# Altium schematic sheet rtpi.SchDoc
size A4
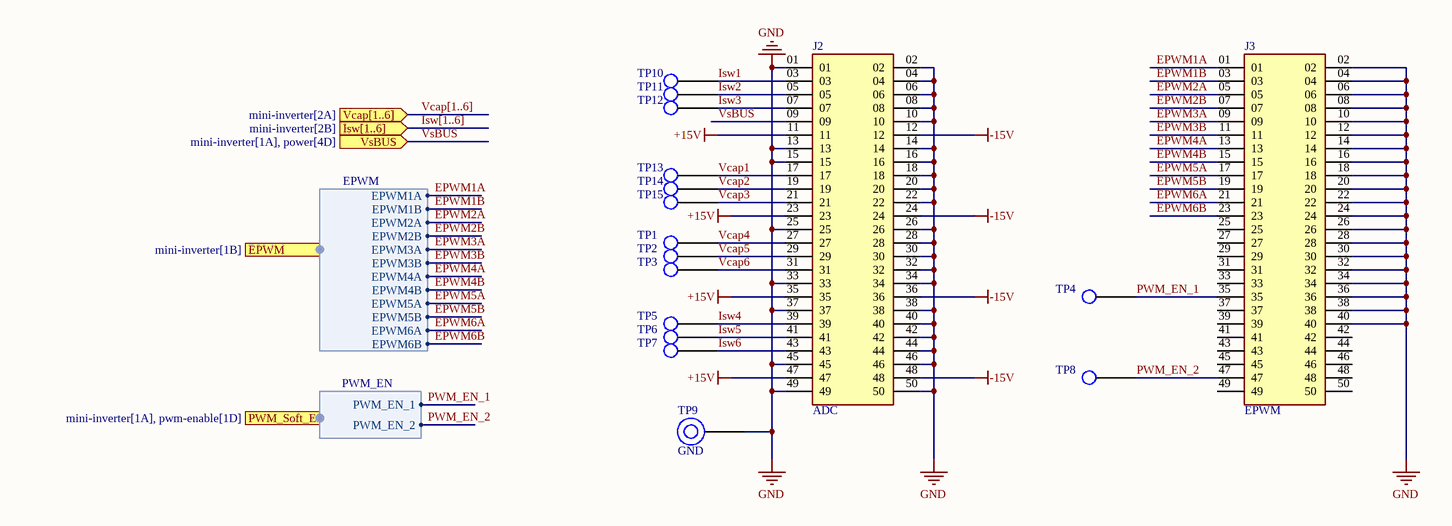
[diagram p0: rtpi.SchDoc]

## Parts
J2  ADC  [SHF-125-01-L-D-RA]
J3  EPWM  [SHF-125-01-L-D-RA]
TP1  VC_1A  [PCB 1.32mm TestPoint]  (value not drawn)
TP2  VC_1B  [PCB 1.32mm TestPoint]  (value not drawn)
TP3  VC_1C  [PCB 1.32mm TestPoint]  (value not drawn)
TP4  PWMEN1  [PCB 1.32mm TestPoint]  (value not drawn)
TP5  I1  [PCB 1.32mm TestPoint]  (value not drawn)
TP6  I2  [PCB 1.32mm TestPoint]  (value not drawn)
TP7  I3  [PCB 1.32mm TestPoint]  (value not drawn)
TP8  PWMEN2  [PCB 1.32mm TestPoint]  (value not drawn)
TP9  GND  [1.9mm Hole]
TP10  VC_1A  [PCB 1.32mm TestPoint]  (value not drawn)
TP11  VC_1B  [PCB 1.32mm TestPoint]  (value not drawn)
TP12  VC_1C  [PCB 1.32mm TestPoint]  (value not drawn)
TP13  VC_1A  [PCB 1.32mm TestPoint]  (value not drawn)
TP14  VC_1B  [PCB 1.32mm TestPoint]  (value not drawn)
TP15  VC_1C  [PCB 1.32mm TestPoint]  (value not drawn)

## Ports
EPWM (harness EPWM, see mini-inverter[1B]), Isw[1..6] (in, see mini-inverter[2B]), PWM_Soft_Enable (harness PWM_EN, see mini-inverter[1A], pwm-enable[1D]), Vcap[1..6] (in, see mini-inverter[2A]), VsBUS (in, see mini-inverter[1A], power[4D])

## Harnesses
EPWM: EPWM1A, EPWM2A, EPWM2B, EPWM3A, EPWM3B, EPWM1B, EPWM4A, EPWM4B, EPWM5A, EPWM5B, EPWM6A, EPWM6B
PWM_EN: PWM_EN_1, PWM_EN_2

## Nets
+15V: J2.11 J2.23 J2.35 J2.47
-15V: J2.12 J2.24 J2.36 J2.48
GND: J2.01 J2.02 J2.04 J2.06 J2.08 J2.10 J2.13 J2.14 J2.15 J2.16 J2.18 J2.20 J2.22 J2.25 J2.26 J2.28 J2.30 J2.32 J2.33 J2.34 J2.37 J2.38 J2.40 J2.42 J2.44 J2.45 J2.46 J2.49 J2.50 J3.02 J3.04 J3.06 J3.08 J3.10 J3.12 J3.14 J3.16 J3.18 J3.20 J3.22 J3.24 J3.26 J3.28 J3.30 J3.32 J3.34 J3.36 J3.38 J3.40 TP9.1
EPWM1A: J3.01 ; port EPWM.EPWM1A
EPWM1B: J3.03 ; port EPWM.EPWM1B
EPWM2A: J3.05 ; port EPWM.EPWM2A
EPWM2B: J3.07 ; port EPWM.EPWM2B
EPWM3A: J3.09 ; port EPWM.EPWM3A
EPWM3B: J3.11 ; port EPWM.EPWM3B
EPWM4A: J3.13 ; port EPWM.EPWM4A
EPWM4B: J3.15 ; port EPWM.EPWM4B
EPWM5A: J3.17 ; port EPWM.EPWM5A
EPWM5B: J3.19 ; port EPWM.EPWM5B
EPWM6A: J3.21 ; port EPWM.EPWM6A
EPWM6B: J3.23 ; port EPWM.EPWM6B
Isw1: J2.03 TP10.1
Isw2: J2.05 TP11.1
Isw3: J2.07 TP12.1
Isw4: J2.39 TP5.1
Isw5: J2.41 TP6.1
Isw6: J2.43 TP7.1
PWM_EN_1: J3.35 TP4.1 ; port PWM_Soft_Enable.PWM_EN_1
PWM_EN_2: J3.47 TP8.1 ; port PWM_Soft_Enable.PWM_EN_2
Vcap1: J2.17 TP13.1
Vcap2: J2.19 TP14.1
Vcap3: J2.21 TP15.1
Vcap4: J2.27 TP1.1
Vcap5: J2.29 TP2.1
Vcap6: J2.31 TP3.1
VsBUS: J2.09 ; port VsBUS

Not connected (* = marked no-connect by the designer): J3 25 27 29 31 33 37 39 41 42 43 44 45 46 48 49 50

## Buses and harness runs
bus Isw[1..6] = port Isw[1..6]
bus Vcap[1..6] = port Vcap[1..6]

## Library data of the parts
J2 J3 = SHF-125-01-L-D-RA: 50-Pin Simplus Connector; MF: Samtec; MP: SHF-125-01-L-D-RA; Package: None; Price: None; Availability: Unavailable; Value: *
TP1-TP8 TP10-TP15 = PCBTestpoint: 20-313143 PCB Test Point, White, Through Hole Mount, 1.32 mm, Phosphor Bronze, Tin Plated Contacts
TP9 = GroundTestPoint: H2182-01 PCB Test Point, PCB Mount, 1.9 mm, Brass, Tin Plated Contacts